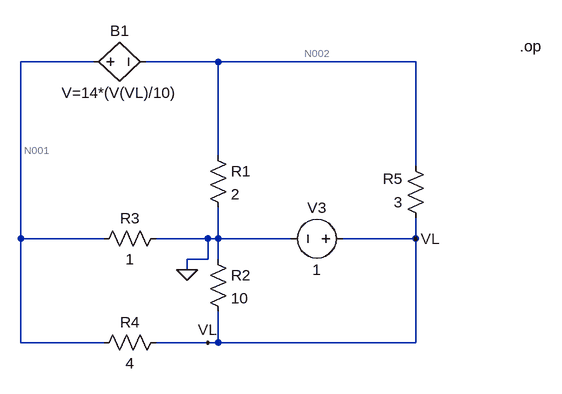
[diagram p0: schematic Schematic2.asc]
Schematic2.asc, the LTspice schematic file:
Version 4
SHEET 1 880 680
WIRE 16 0 -96 0
WIRE 208 0 96 0
WIRE 512 0 208 0
WIRE 208 144 208 0
WIRE 512 160 512 0
WIRE -96 272 -96 0
WIRE 32 272 -96 272
WIRE 192 272 112 272
WIRE 208 272 208 224
WIRE 208 272 192 272
WIRE 320 272 208 272
WIRE 512 272 512 240
WIRE 512 272 400 272
WIRE 192 304 192 272
WIRE 192 304 160 304
WIRE 208 304 208 272
WIRE 160 320 160 304
WIRE -96 432 -96 272
WIRE 32 432 -96 432
WIRE 192 432 112 432
WIRE 208 432 208 384
WIRE 208 432 192 432
WIRE 512 432 512 272
WIRE 512 432 208 432
FLAG 192 432 VL
FLAG 160 320 0
FLAG 512 272 VL
SYMBOL res 192 128 R0
SYMATTR InstName R1
SYMATTR Value 2
SYMBOL res 192 288 R0
SYMATTR InstName R2
SYMATTR Value 10
SYMBOL res 128 256 R90
WINDOW 0 0 56 VBottom 2
WINDOW 3 32 56 VTop 2
SYMATTR InstName R3
SYMATTR Value 1
SYMBOL res 128 416 R90
WINDOW 0 0 56 VBottom 2
WINDOW 3 32 56 VTop 2
SYMATTR InstName R4
SYMATTR Value 4
SYMBOL res 528 256 R180
WINDOW 0 36 76 Left 2
WINDOW 3 36 40 Left 2
SYMATTR InstName R5
SYMATTR Value 3
SYMBOL bv 0 0 R270
WINDOW 0 32 56 VTop 2
WINDOW 3 -32 56 VBottom 2
SYMATTR InstName B1
SYMATTR Value V=14*(V(VL)/10)
SYMBOL voltage 416 272 R90
WINDOW 0 -32 56 VBottom 2
WINDOW 3 32 56 VTop 2
SYMATTR InstName V3
SYMATTR Value 1
TEXT 672 -24 Left 2 !.op

The netlist it stands for:
* Schematic2.asc
R1 N002 0 2
R2 0 VL 10
R3 0 N001 1
R4 VL N001 4
R5 VL N002 3
B1 N001 N002 V=14*(V(VL)/10)
V3 VL 0 1
.op
.backanno
.end

* Results of the author's LTspice run, read from the files saved beside the schematic
* Operating Point:
*   V(n002) = -560 mV
*   V(vl) = 1 V
*   V(n001) = 840 mV
*   I(B1) = -800 mA
*   I(R5) = 520 mA
*   I(R4) = 40 mA
*   I(R3) = -840 mA
*   I(R2) = -100 mA
*   I(R1) = -280 mA
*   I(V3) = -660 mA